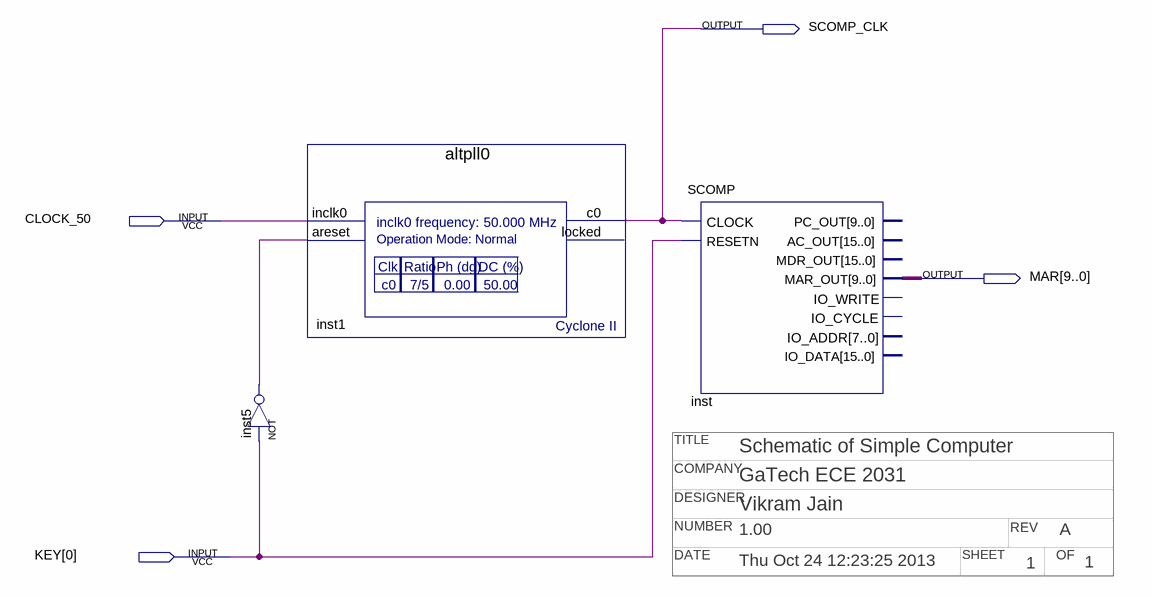
[diagram p0: schematic sheet]
// Quartus schematic TOP_SCOMP.bdf as structural Verilog: 3 symbols, 4 pins
// Title block: TITLE: Schematic of Simple Computer; COMPANY: GaTech ECE 2031; DESIGNER: Vikram Jain; NUMBER: 1.00; REV: A; DATE: Thu Oct 24 12:23:25 2013; SHEET: 1; OF: 1
module TOP_SCOMP (
  input  CLOCK_50,
  input  [0:0] KEY,
  output SCOMP_CLK,
  output [9:0] MAR
);

  wire inst5_out;

  not inst5 (inst5_out, KEY[0]);
  altpll0 inst1 (.inclk0(CLOCK_50), .areset(inst5_out), .c0(SCOMP_CLK));  // open: locked
  SCOMP inst (
    .CLOCK(SCOMP_CLK), .RESETN(KEY[0]), .MAR_OUT(MAR));  // open: PC_OUT, AC_OUT, MDR_OUT, IO_WRITE, IO_CYCLE, IO_ADDR, IO_DATA
endmodule
